# EAGLE design SnapBIT-DELTA (EAGLE 7.1.0)
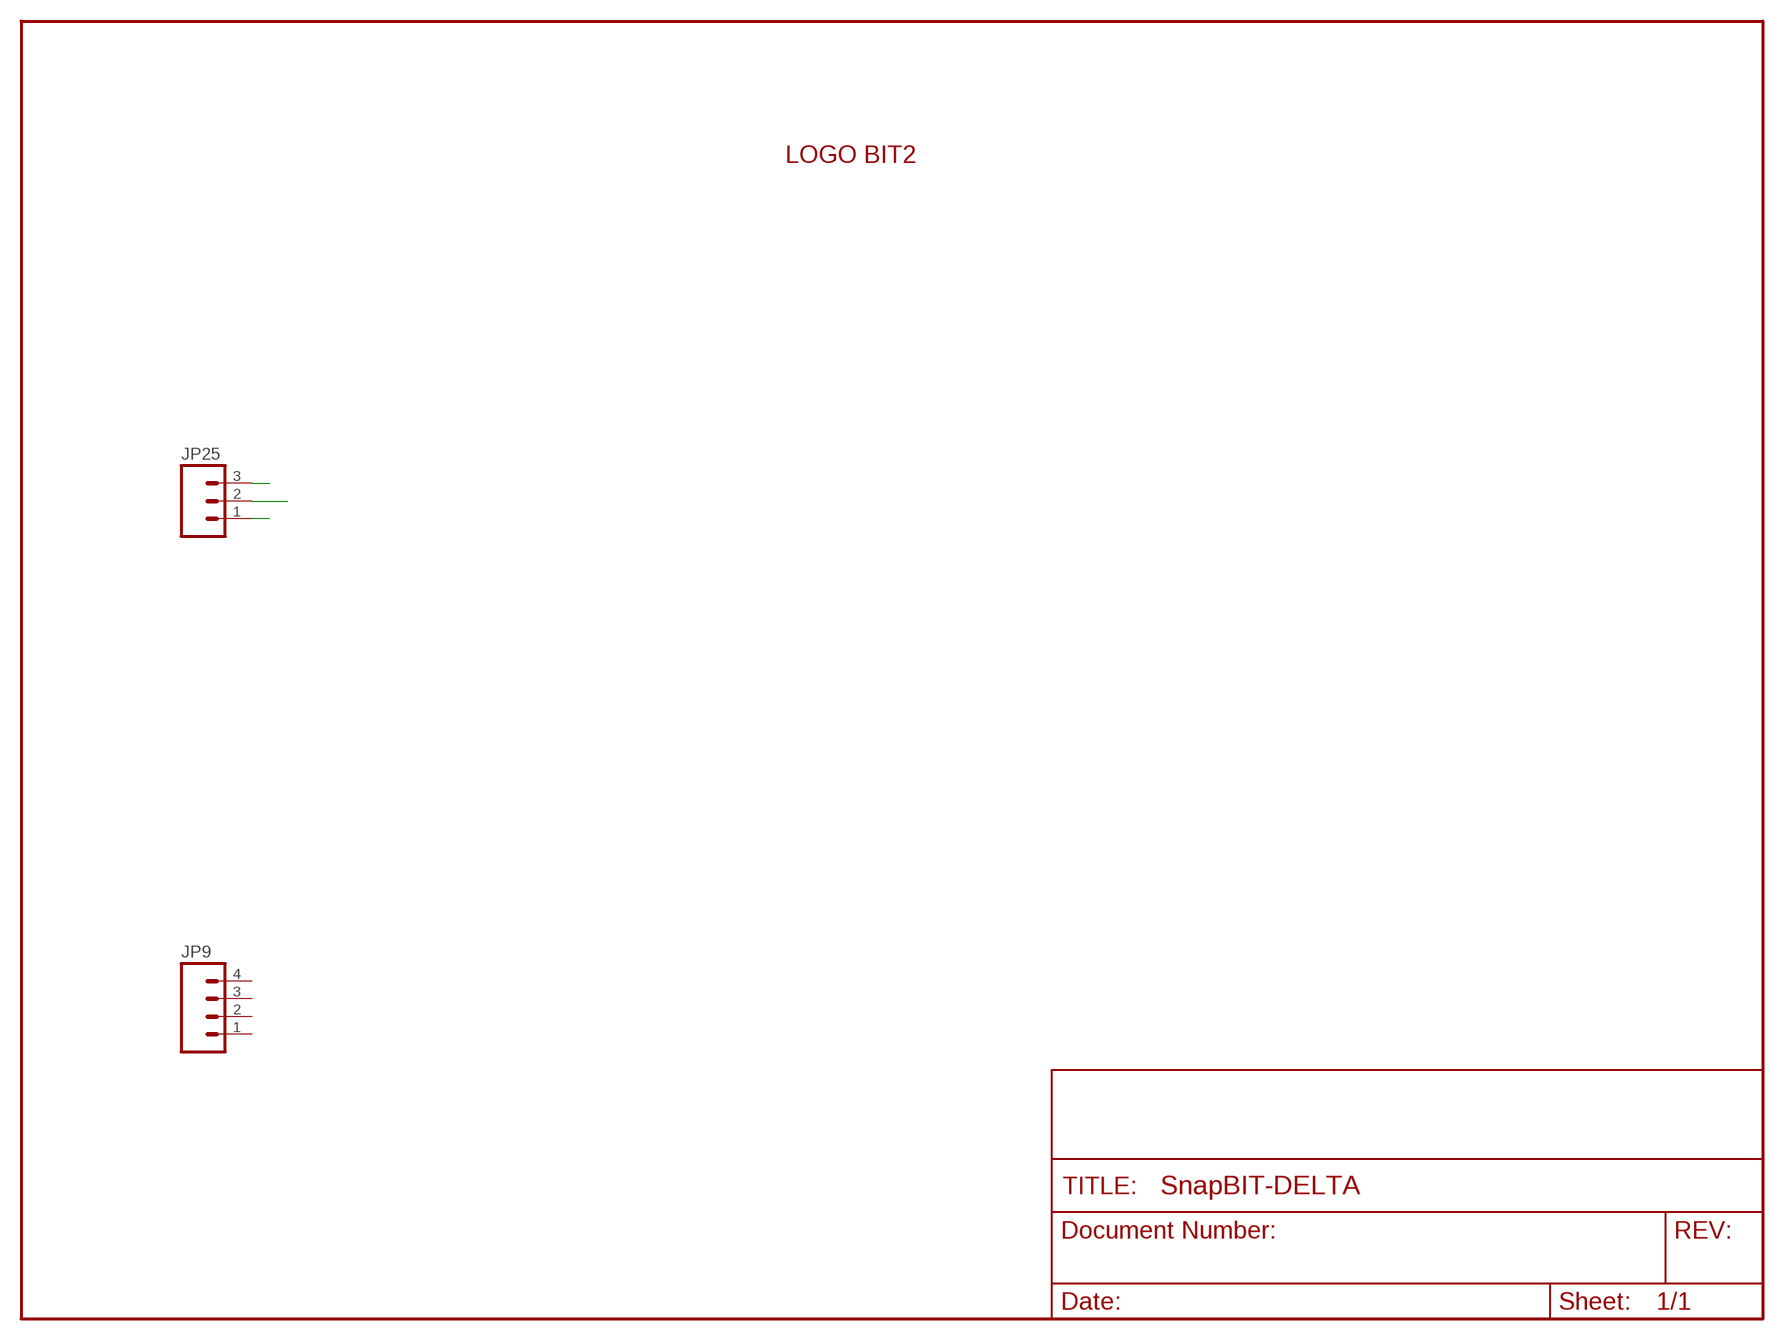
[diagram p0: schematic, sheet 1]

## Parts
JP9  M04JST-PTH  [JST-4-PTH]
JP25  M03JST-PTH  [JST-3-PTH]
U$1  LOGO_BIT2(4.72X3.78)  [LOGO_BIT2]

## Nets
IN+: JP25.1
IN-: JP25.3
REF: JP25.2
Unconnected: JP9.1 JP9.2 JP9.3 JP9.4

## Library data of the parts
JP9 = SparkFun:M04: Header 4 Standard 4-pin 0.1" header. Use with straight break away headers (SKU : PRT-00116), right angle break away headers (PRT-00553), swiss pins (PRT-00743), machine pins (PRT-00117), and female headers (PRT-00115). Molex polarized connector foot print use with SKU : PRT-08231 with associated crimp pins and housings. 1MM SMD Version SKU: PRT-10208
JP25 = SparkFun:M03: Header 3 Standard 3-pin 0.1" header. Use with straight break away headers (SKU : PRT-00116), right angle break away headers (PRT-00553), swiss pins (PRT-00743), machine pins (PRT-00117), and female headers (PRT-00115). Molex polarized connector foot print use with SKU : PRT-08232 with associated crimp pins and housings.
U$1 = bit2_logo_27x8:LOGO_BIT2(4.72X3.78)

## Board
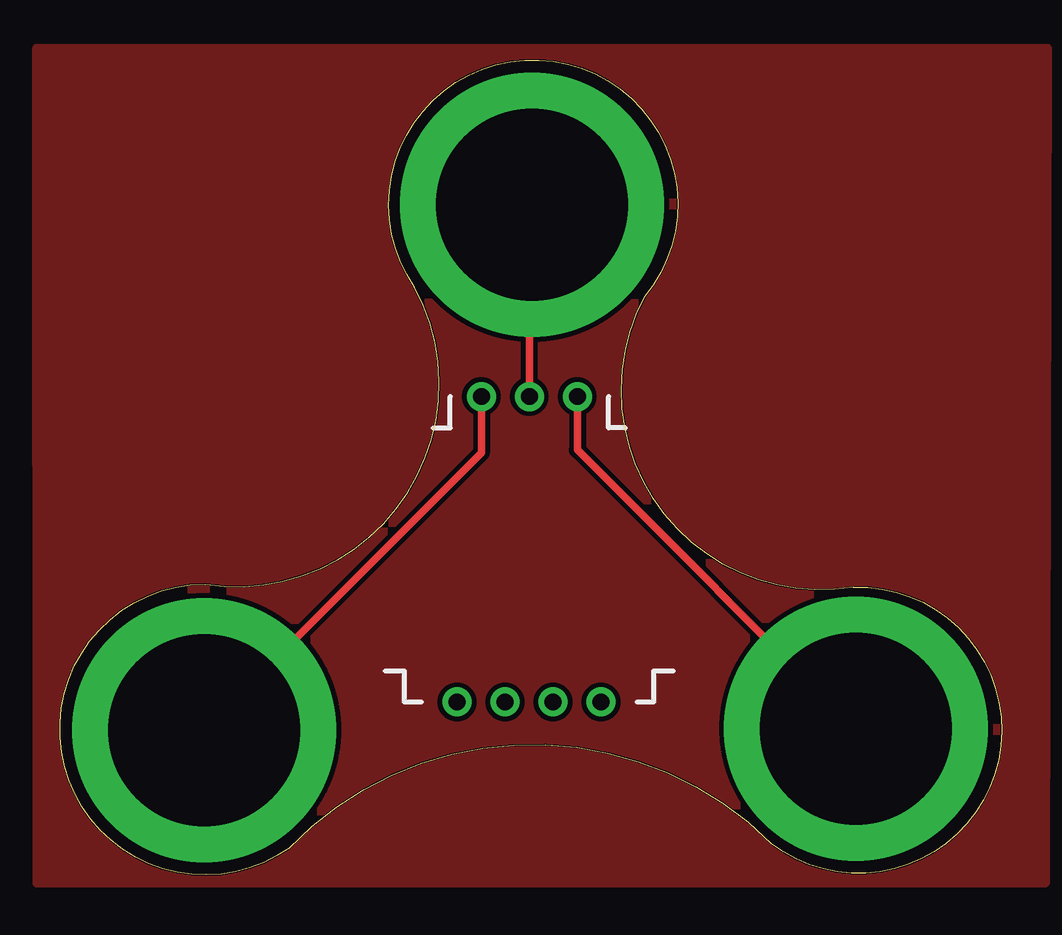
[diagram p1: board, top side]
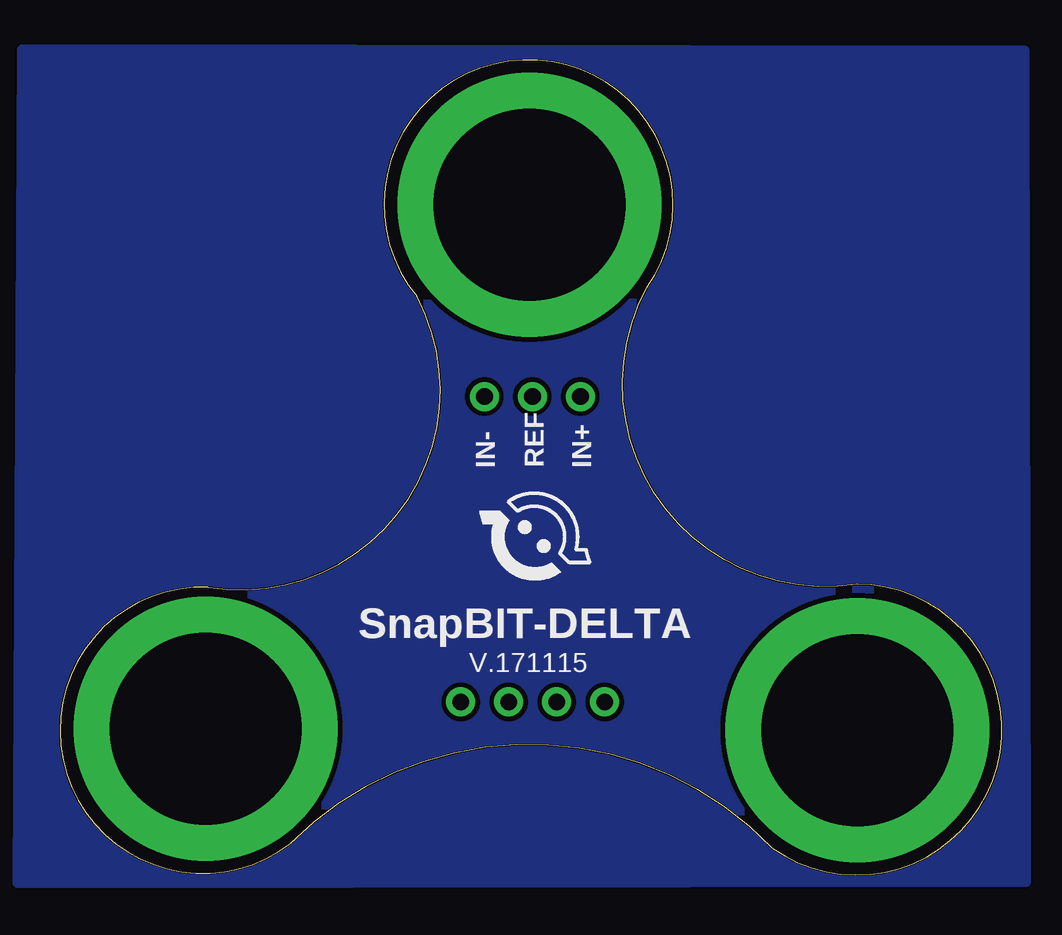
[diagram p2: board, bottom side, seen from below]

Size 39.26 x 33.95 mm. Coordinates in mm from the lower left corner, seen from the top.
Outline: 14.79,24.48 arc-254 24.38,24.1 arc127 33.08,11.99 arc-220 29.66,1.3 arc91 9.56,1.12 arc-215 6.04,12.11 arc127 14.79,24.48
Copper layers (1*16): Top 0.035mm / dielectric 1mm / Bottom 0.035mm
Design rules "bitalino *": minimum track width 6mil, minimum drill 8mil, track to track 8mil, track to pad 8mil, pad to pad 8mil, via to via 8mil, smd to smd 8mil, copper to edge 2mil, drill to drill 8mil, minimum pad ring 10mil, minimum via ring 8mil, stop-mask expansion 6mil, vias tented up to drill 15mil, thermal gap 8mil

### Footprints (pad centres in the part's own frame; a part is rotated, then mirrored left to right if it is on the bottom)
JST-4-PTH = drill 0.7: 1 -3,-5; 2 -1,-5; 3 1,-5; 4 3,-5
JST-3-PTH = drill 0.7: 1 -2,-5; 2 0,-5; 3 2,-5

### Placement (x,y rotation side)
JP9  19.55,2.21 180 top
JP25  19.57,24.93 0 top
U$1  17.11,16.01 180 bottom

### Tracks (layer width: path | path; a pad name or v marks a point on that pad's centre or on a via)
GND
  pour Bottom: 40.84,34.4 41.04,-0.34 -1.02,-0.29 -0.95,34.34
  pour Top: 41.14,34.43 41.06,-0.32 -0.93,-0.33 -0.94,34.45
IN+  (via drill 8 pad 11)
  Top 0.305: JP25.1 17.57,17.58 v6.02,6.03
IN-  (via drill 8 pad 11)
  Top 0.305: JP25.3 21.57,17.71 v33.18,6.09
REF  (via drill 8 pad 11)
  Top 0.305: 19.57,19.76 JP25.2 19.57,27.81 v19.68,27.92

### Text on the board
_bsilk: IN+ | REF | IN- | SnapBIT-DELTA | V.171115